# Altium schematic sheet sch_io.SchDoc
size B; SheetNumber: 3; SheetTotal: 7
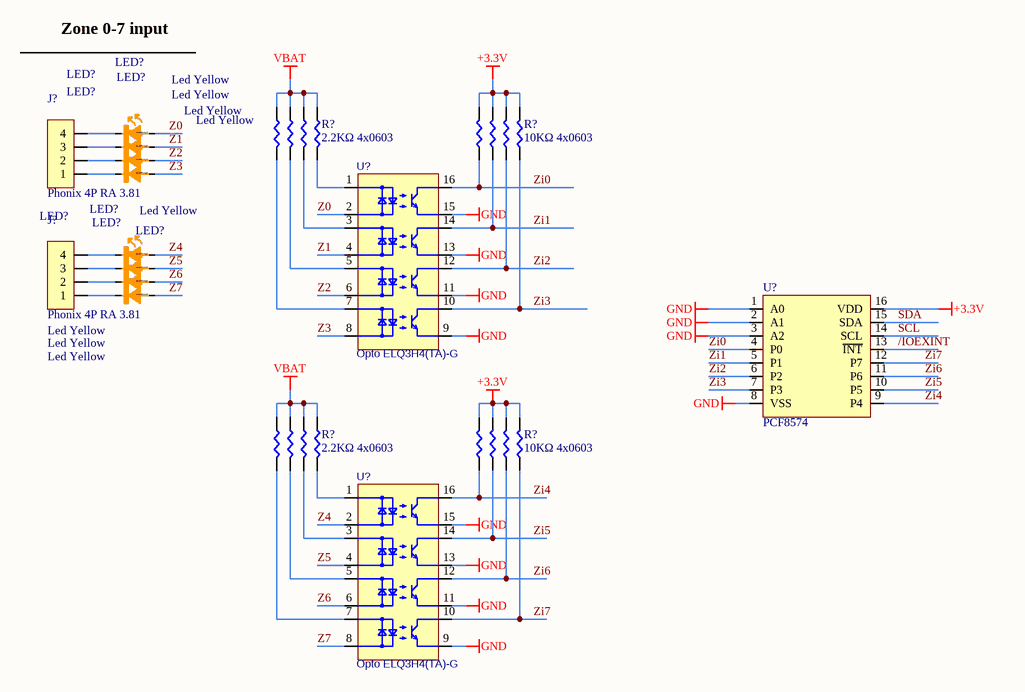
[diagram p0: sch_io.SchDoc]

## Parts
(Parts that share a designator on the sheet are numbered #1, #2 ... from top to bottom, then left to right.)
J?#1  Phonix 4P RA 3.81  [TER4-R-3.81]
J?#2  Phonix 4P RA 3.81  [TER4-R-3.81]
LED?#1  Led Yellow  [LED0603Y]
LED?#2  Led Yellow  [LED0603Y]
LED?#3  Led Yellow  [LED0603Y]
LED?#4  Led Yellow  [LED0603Y]
LED?#5  Led Yellow  [LED0603Y]
LED?#6  Led Yellow  [LED0603Y]
LED?#7  Led Yellow  [LED0603Y]
LED?#8  Led Yellow  [LED0603Y]
R?#1  2.2KΩ 4x0603  [0603ARRAY]
R?#2  10KΩ 4x0603  [0603ARRAY]
R?#3  2.2KΩ 4x0603  [0603ARRAY]
R?#4  10KΩ 4x0603  [0603ARRAY]
U?#1  Opto ELQ3H4(TA)-G  [SOP-16_L10.3-W4.4-P1.27-LS7.0-BL]
U?#2  PCF8574  [SOIC-16_L10.3-W7.5-P1.27-LS10.3-BL]
U?#3  Opto ELQ3H4(TA)-G  [SOP-16_L10.3-W4.4-P1.27-LS7.0-BL]

## Nets
+3.3V: R?#2.5(R5) R?#2.6(R6) R?#2.7(R7) R?#2.8(R8) R?#4.5(R5) R?#4.6(R6) R?#4.7(R7) R?#4.8(R8) U?#2.16(VDD)
GND: U?#1.9(EMI1) U?#1.11(EMI2) U?#1.13(EMI3) U?#1.15(EMI4) U?#2.1(A0) U?#2.2(A1) U?#2.3(A2) U?#2.8(VSS) U?#3.9(EMI1) U?#3.11(EMI2) U?#3.13(EMI3) U?#3.15(EMI4)
VBAT: R?#1.5(R5) R?#1.6(R6) R?#1.7(R7) R?#1.8(R8) R?#3.5(R5) R?#3.6(R6) R?#3.7(R7) R?#3.8(R8)
/IOEXINT: U?#2.13(~{INT})
SCL: U?#2.14(SCL)
SDA: U?#2.15(SDA)
Z0: LED?#1.A U?#1.2(C-A1)
Z1: LED?#2.A U?#1.4(C-A2)
Z2: LED?#3.A U?#1.6(C-A3)
Z3: LED?#4.A U?#1.8(C-A4)
Z4: LED?#5.A U?#3.2(C-A1)
Z5: LED?#6.A U?#3.4(C-A2)
Z6: LED?#7.A U?#3.6(C-A3)
Z7: LED?#8.A U?#3.8(C-A4)
Zi0: R?#2.4(R4) U?#1.16(COL4) U?#2.4(P0)
Zi1: R?#2.3(R3) U?#1.14(COL3) U?#2.5(P1)
Zi2: R?#2.2(R2) U?#1.12(CO2) U?#2.6(P2)
Zi3: R?#2.1(R1) U?#1.10(COL1) U?#2.7(P3)
Zi4: R?#4.4(R4) U?#2.9(P4) U?#3.16(COL4)
Zi5: R?#4.3(R3) U?#2.10(P5) U?#3.14(COL3)
Zi6: R?#4.2(R2) U?#2.11(P6) U?#3.12(CO2)
Zi7: R?#4.1(R1) U?#2.12(P7) U?#3.10(COL1)
NetJ?#1_1: J?#1.1 LED?#4.K
NetJ?#1_2: J?#1.2 LED?#3.K
NetJ?#1_3: J?#1.3 LED?#2.K
NetJ?#1_4: J?#1.4 LED?#1.K
NetJ?#2_1: J?#2.1 LED?#8.K
NetJ?#2_2: J?#2.2 LED?#7.K
NetJ?#2_3: J?#2.3 LED?#6.K
NetJ?#2_4: J?#2.4 LED?#5.K
NetR?#1_1: R?#1.1(R1) U?#1.7(A-C4)
NetR?#1_2: R?#1.2(R2) U?#1.5(A-C3)
NetR?#1_3: R?#1.3(R3) U?#1.3(A-C2)
NetR?#1_4: R?#1.4(R4) U?#1.1(A-C1)
NetR?#3_1: R?#3.1(R1) U?#3.7(A-C4)
NetR?#3_2: R?#3.2(R2) U?#3.5(A-C3)
NetR?#3_3: R?#3.3(R3) U?#3.3(A-C2)
NetR?#3_4: R?#3.4(R4) U?#3.1(A-C1)

## Notes on the sheet
- Zone 0-7 input
- (in symbol LedYellow) @DesignPCB

## Library data of the parts
J?#1 J?#2 = Phonix 4P RA: MFAC: DB2ERC-3.81-4P-GN; JLC: C395698
LED?#1-LED?#8 = LedYellow: MFAC: XL-1608UWC-04; JLC: C965808
R?#1 R?#3 = R2.2K Array: MFAC: 4D03WGJ0222T5E; JLC: C12001
R?#2 R?#4 = R10K Array: MFAC: 4D03WGJ0103T5E; JLC: C29718
U?#1 U?#3 = ELQ3H4(TA)-G: JLC: C150957; MFAC: ELQ3H4(TA)-G
U?#2 = PCF8574: MFAC: PCF8574T/3,518; JLC: C7605